# EAGLE board MainECU rev1 (EAGLE 9.2.2)
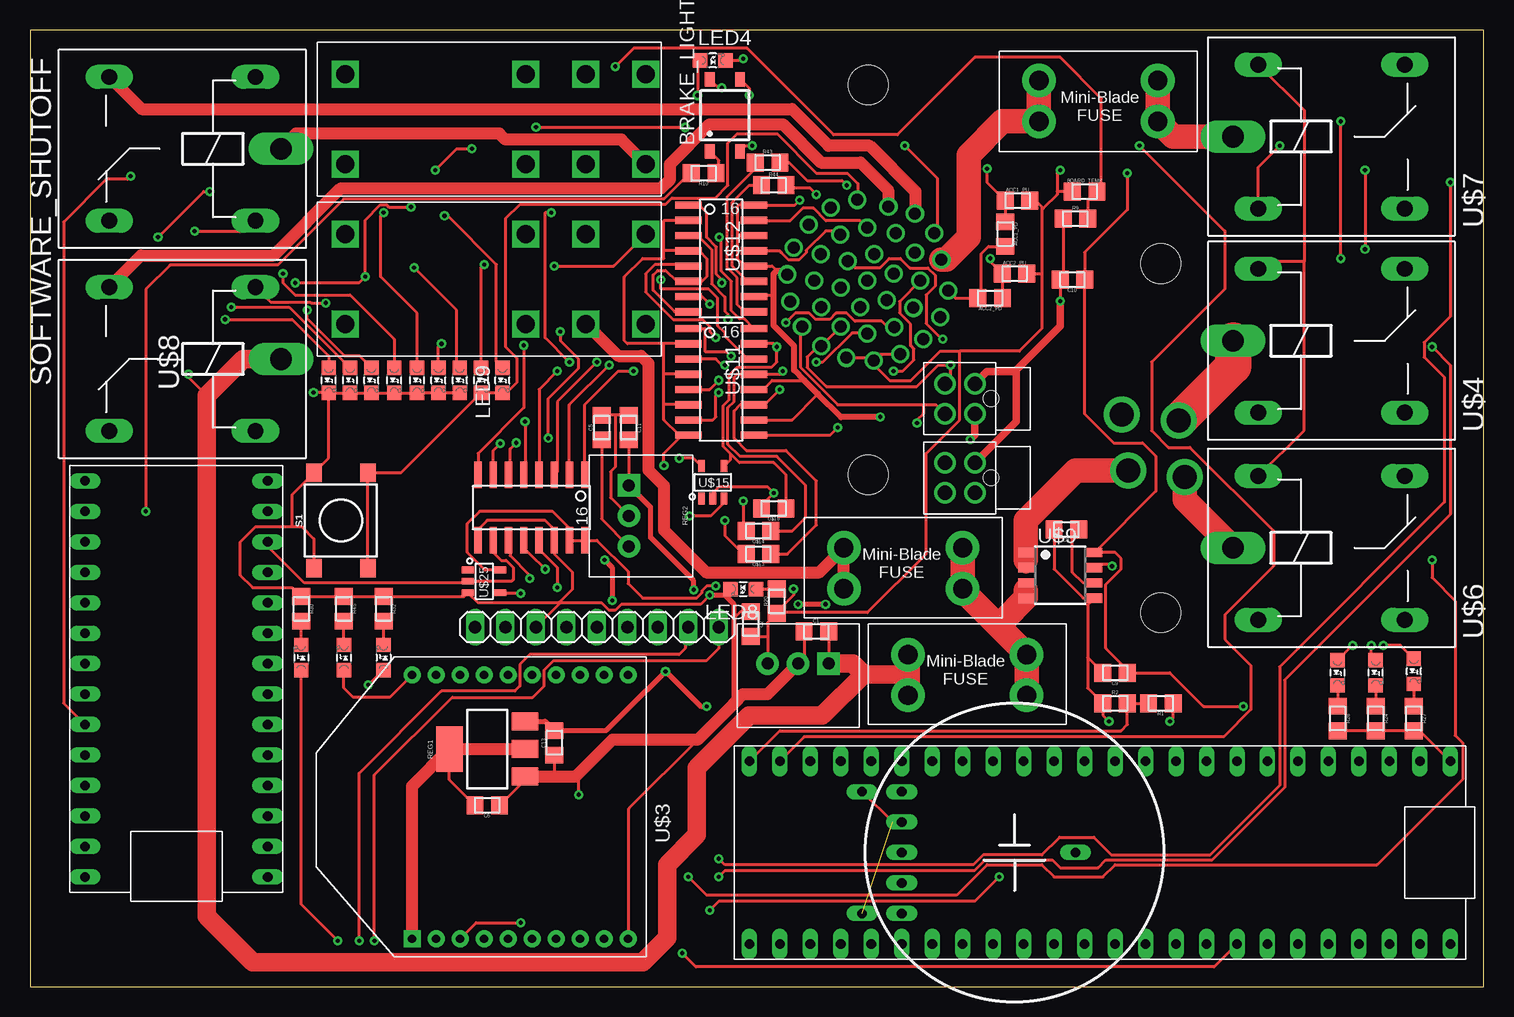
[diagram p1: board, top side]
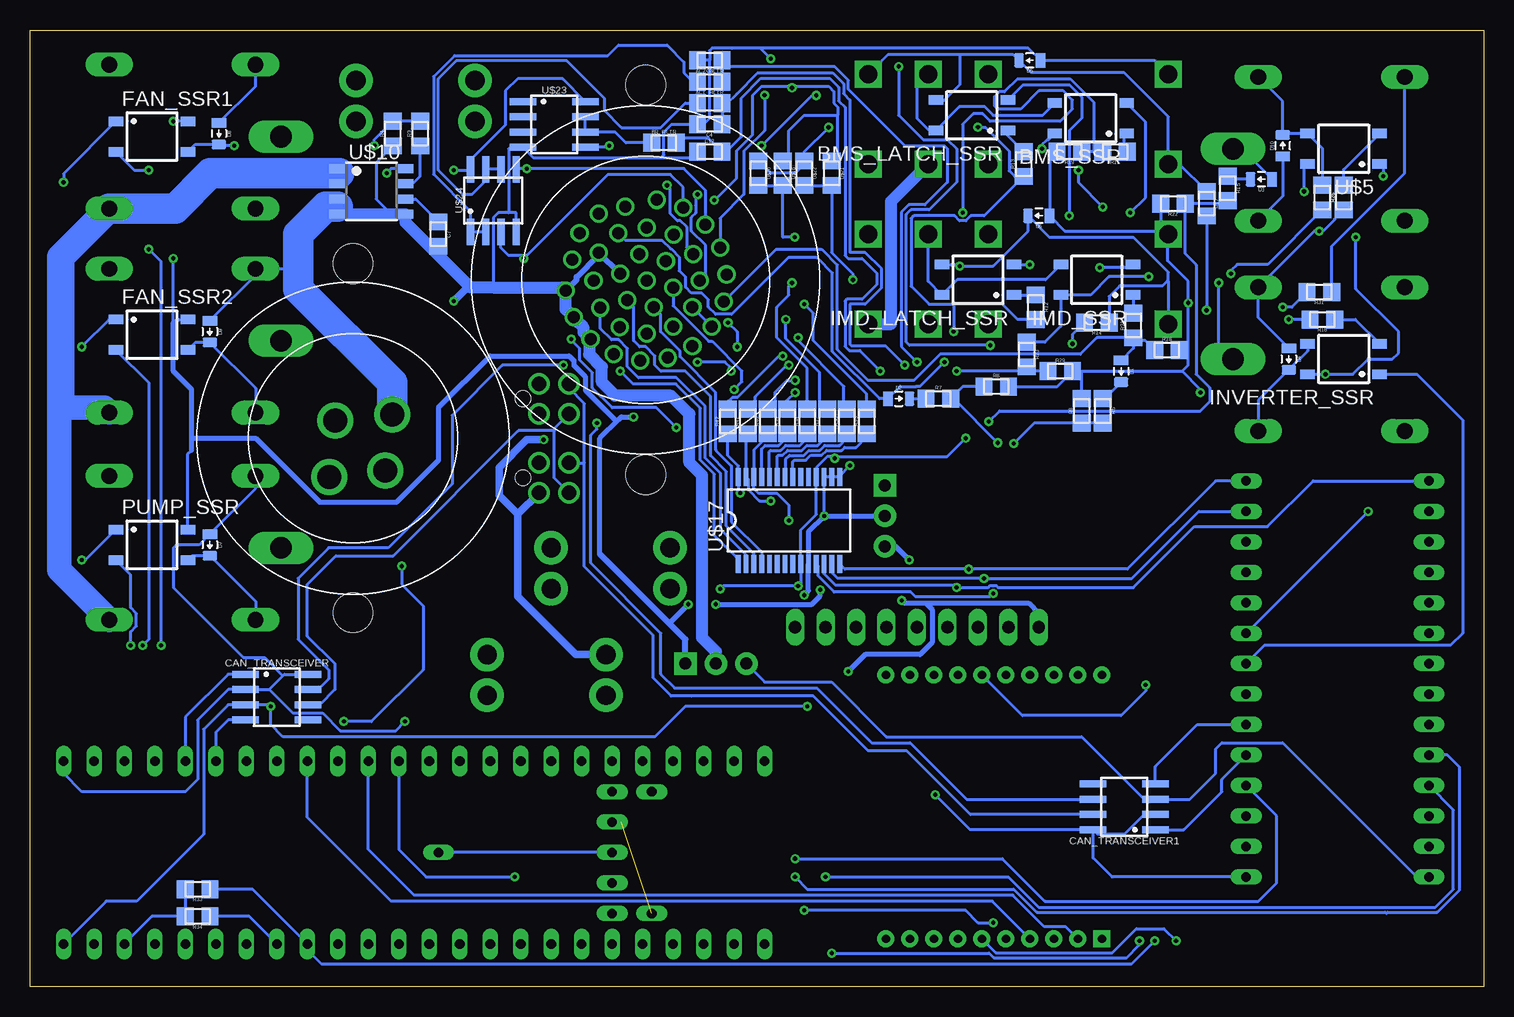
[diagram p2: board, bottom side, seen from below]

Size 121.16 x 79.76 mm. Coordinates in mm from the lower left corner, seen from the top.
Outline: 0,0 121.16,0 121.16,79.76 0,79.76 0,0
Copper layers (1*16): Top 0.035mm / dielectric 1.5mm / Bottom 0.035mm
Design rules "DRC Advanced Circuits": minimum track width 6mil, minimum drill 10mil, track to track 6mil, track to pad 6mil, pad to pad 6mil, via to via 6mil, smd to smd 6mil, copper to edge 40mil, drill to drill 6mil, minimum pad ring 10mil, minimum via ring 8mil, stop-mask expansion 4mil, vias tented up to drill 0mil, thermal gap 10mil

## Footprints (pad centres in the part's own frame; a part is rotated, then mirrored left to right if it is on the bottom)
MINI-BLADE_FUSE_HOLDER = drill 1.613 pad 2.794: L1 0,3.404; L2 0,0; R1 9.906,3.404; R2 9.906,0
0805 = smd 1.4 x 1.5: 1 -1.025,0; 2 1.025,0
1X09 = drill 1.016 long: 1 -8.89,0; 2 -6.35,0; 3 -3.81,0; 4 -1.27,0; 5 1.27,0; 6 3.81,0; 7 6.35,0; 8 8.89,0; 9 11.43,0
SOP04 = smd 0.8 x 1.2: 1 -1.27,-3; 2 1.27,-3; 3 1.27,3; 4 -1.27,3
SOIC-08 = smd 0.6 x 2.2: 1 -1.905,-2.6; 2 -0.635,-2.6; 3 0.635,-2.6; 4 1.905,-2.6; 5 1.905,2.6; 6 0.635,2.6; 7 -0.635,2.6; 8 -1.905,2.6
0805_D = smd 0.8 x 1.2: A -0.9,0; C 0.9,0
G2RL-2 = drill 1.5 square: 2 10.008,0; 3 5.004,0; 4 0,0; 5 0,7.493; 6 5.004,7.493; 7 10.008,7.493; COIL+ 25.019,0; COIL- 25.019,7.493
LED-805 = smd 1.2 x 1.2: A 0,-1.05; C 0,1.05
OKI-78SR = drill 1 pad 1.88 square: 1 -2.54,0 | drill 1 pad 1.88: 2 0,0; 3 2.54,0
SOT223 = smd 1.5 x 2.235: 1 -2.3,-3.15; 2 0,-3.15; 3 2.3,-3.15 | smd 3.8 x 2.2: 4 0,3.15
TACTILE_SWITCH_SMD_6.2MM_TALL = smd 1.55 x 1.3: A1 -3.975,-2.25; A2 3.975,-2.25; B1 -3.975,2.25; B2 3.975,2.25
ZF112 = drill 1.321 long: 1 4.064,14.884; 2 4.064,2.896; O 16.256,14.884; S 16.256,2.896 | drill 1.803 long: P 1.956,8.89
TEENSY_3.2_SIMPLE = drill 0.8 long: 3.3V 16.51,29.21; A0 16.51,3.81; A1 16.51,6.35; A2 16.51,8.89; A3 16.51,11.43; A4 16.51,13.97; A5 16.51,16.51; A6 16.51,19.05; A7 16.51,21.59; A8 16.51,24.13; A9 16.51,26.67; AGND 16.51,31.75; D0(RX1) 1.27,31.75; D1(TX1) 1.27,29.21; D2 1.27,26.67; D3(CANTX) 1.27,24.13; D4(CANRX) 1.27,21.59; D5 1.27,19.05; D6 1.27,16.51; D7(RX3) 1.27,13.97; D8(TX3) 1.27,11.43; D9(RX2) 1.27,8.89; D10(TX2) 1.27,6.35; D11 1.27,3.81; D12 1.27,1.27; D13 16.51,1.27; GND 1.27,34.29; VIN 16.51,34.29
TEENSY_3.5_EXT = drill 0.8 long: 3.3V 16.51,54.61; 3.3V_1 1.27,24.13; 3.3V_2 6.35,13.97; A0 16.51,29.21; A1 16.51,31.75; A2 16.51,34.29; A3 16.51,36.83; A4 16.51,39.37; A5 16.51,41.91; A6 16.51,44.45; A7 16.51,46.99; A8 16.51,49.53; A9 16.51,52.07; A12 1.27,3.81; A13 1.27,1.27; A14 16.51,1.27; A15 16.51,3.81; A16 16.51,6.35; A17 16.51,8.89; A18 16.51,11.43; A19 16.51,13.97; A20 16.51,16.51; A21 16.51,19.05; A22 16.51,21.59; AGND 16.51,57.15; D0(RX1) 1.27,57.15; D1(TX1) 1.27,54.61; D2 1.27,52.07; D3(CANTX) 1.27,49.53; D4(CANRX) 1.27,46.99; D5 1.27,44.45; D6 1.27,41.91; D7(RX3) 1.27,39.37; D8(TX3) 1.27,36.83; D9(RX2) 1.27,34.29; D10(TX2) 1.27,31.75; D11 1.27,29.21; D12 1.27,26.67; D13 16.51,26.67; D24 1.27,21.59; D25 1.27,19.05; D26 1.27,16.51; D27 1.27,13.97; D28 1.27,11.43; D29 1.27,8.89; D30 1.27,6.35; GND 1.27,59.69; GND_1 16.51,24.13; GND_2 8.89,13.97; PROG 11.43,13.97; RST 13.97,13.97; VBAT 3.81,13.97; VIN 16.51,59.69
XBEE = drill 0.7 pad 1.422 square: 1 -11,5.5 | drill 0.7 pad 1.422: 2 -11,3.5; 3 -11,1.5; 4 -11,-0.5; 5 -11,-2.5; 6 -11,-4.5; 7 -11,-6.5; 8 -11,-8.5; 9 -11,-10.5; 10 -11,-12.5; 11 11,-12.5; 12 11,-10.5; 13 11,-8.5; 14 11,-6.5; 15 11,-4.5; 16 11,-2.5; 17 11,-0.5; 18 11,1.5; 19 11,3.5; 20 11,5.5
SOP8 = smd 0.76 x 1.27: 1 -1.905,-2.86; 2 -0.635,-2.86; 3 0.635,-2.86; 4 1.905,-2.86; 5 1.905,2.86; 6 0.635,2.86; 7 -0.635,2.86; 8 -1.905,2.86
SOIC-16 = smd 0.6 x 2.2: 1 -4.445,-2.794; 2 -3.175,-2.794; 3 -1.905,-2.794; 4 -0.635,-2.794; 5 0.635,-2.794; 6 1.905,-2.794; 7 3.175,-2.794; 8 4.445,-2.794; 9 4.445,2.667; 10 3.175,2.667; 11 1.905,2.667; 12 0.635,2.667; 13 -0.635,2.667; 14 -1.905,2.667; 15 -3.175,2.667; 16 -4.445,2.667
SOT-23-5 = smd 1 x 0.55: 1 -1.35,0.95; 2 -1.35,0; 3 -1.35,-0.95; 4 1.35,-0.95; 5 1.35,0.95
SSOP28 = smd 0.4 x 1.5: 1 -4.225,-3.625; 2 -3.575,-3.625; 3 -2.925,-3.625; 4 -2.275,-3.625; 5 -1.625,-3.625; 6 -0.975,-3.625; 7 -0.325,-3.625; 8 0.325,-3.625; 9 0.975,-3.625; 10 1.625,-3.625; 11 2.275,-3.625; 12 2.925,-3.625; 13 3.575,-3.625; 14 4.225,-3.625; 15 4.225,3.625; 16 3.575,3.625; 17 2.925,3.625; 18 2.275,3.625; 19 1.625,3.625; 20 0.975,3.625; 21 0.325,3.625; 22 -0.325,3.625; 23 -0.975,3.625; 24 -1.625,3.625; 25 -2.275,3.625; 26 -2.925,3.625; 27 -3.575,3.625; 28 -4.225,3.625
CR-2450/G1AN = drill 0.8 long: +_0 -5.08,12.7; +_1 5.08,12.7; - 0,-5.08
AUTOSPORT_14-35 = drill 1: P$1 1.143,6.655; P$2 3.124,5.512; P$3 5.359,4.064; P$4 6.452,2.032; P$5 6.756,-0.254; P$6 6.274,-2.489; P$7 5.08,-4.445; P$8 3.302,-5.893; P$9 1.143,-6.655; P$10 -1.143,-6.655; P$11 -3.302,-5.893; P$12 -5.08,-4.445; P$13 -6.274,-2.489; P$14 -6.756,-0.254; P$15 -6.452,2.032; P$16 -5.359,4.064; P$17 -3.124,5.512; P$18 -1.143,6.655; P$19 1.143,4.369; P$20 3.124,3.023; P$21 4.318,1.016; P$22 4.318,-1.27; P$23 3.124,-3.226; P$24 1.143,-4.369; P$25 -1.143,-4.369; P$26 -3.124,-3.226; P$27 -4.318,-1.27; P$28 -4.318,1.016; P$29 -3.124,3.023; P$30 -1.143,4.369; P$31 1.143,1.88; P$32 2.286,-0.102; P$33 1.143,-2.083; P$34 -1.143,-2.083; P$35 -2.286,-0.102; P$36 -1.143,1.88; P$37 0,-0.102 | hole 3.3: -11.491,-11.491; 11.491,11.491
AUTOSPORT_12-04 = drill 2: P$1 0,3.81; P$2 3.708,0.889; P$3 0,-2.108; P$4 -3.708,0.889 | hole 3.3: -10.288,-10.288; 10.288,10.288
NANO-FIT_VERTICAL-4 = drill 1.2: P$1 -1.25,0; P$2 1.25,0; P$3 -1.25,2.5; P$4 1.25,2.5 | hole 1.3: 0,-1.34

## Placement (x,y rotation side)
5ABOARDFUSE  [MINI-BLADE_FUSE_HOLDER]  83.06,27.69 180 top
5AFUSE  [MINI-BLADE_FUSE_HOLDER]  84.07,72.14 0 top
5ASHUTDOWNFUSE  [MINI-BLADE_FUSE_HOLDER]  77.72,36.58 180 top
AC1_FILTR  510  [0805]  64.52,73.66 0 bottom
AC2_FILTR  510  [0805]  64.52,75.44 0 bottom
ACC1_PD  10k  [0805]  81.28,62.74 270 top
ACC1_PU  10k  [0805]  82.3,65.53 0 top
ACC2_PD  10k  [0805]  80.01,57.4 180 top
ACC2_PU  10k  [0805]  82.04,59.44 0 top
ADXL345_BREAKOUT  [1X09]  45.97,29.97 0 top
BMS_LATCH_SSR  CPC1002N  [SOP04]  42.67,72.64 90 bottom
BMS_SSR  CPC1002N  [SOP04]  32.77,72.39 90 bottom
BOARD_TEMP  THERMISTOR_NCP210805  [0805]  87.88,66.29 0 top
BR_FILTR  100  [0805]  68.33,70.36 0 bottom
BRAKE_LIGHT_SSR  CPC1002N  [SOP04]  57.91,72.64 0 top
C1  10uF  [0805]  65.53,29.59 0 top
C2  10uF  [0805]  60.07,30.23 270 top
C3  22µ  [0805]  64.52,77.22 180 bottom
C4  22µ  [0805]  64.52,71.88 180 bottom
C5  1uF  [0805]  47.62,46.61 90 top
C6  1uF  [0805]  38.1,15.11 180 top
C7  [0805]  87.12,62.74 270 bottom
C8  [0805]  86.36,38.1 180 top
C9  0.1uF  [0805]  90.42,26.16 180 top
C10  0.1uF  [0805]  86.87,58.93 180 top
C11  10uF  [0805]  49.91,46.61 270 top
C12  2.2µ  [0805]  64.52,69.6 0 bottom
C13  10uF  [0805]  43.69,20.32 90 top
CAN_TRANSCEIVER  MCP2551  [SOIC-08]  100.58,24.13 270 bottom
CAN_TRANSCEIVER1  MCP2551  [SOIC-08]  29.97,14.99 90 bottom
D1  DIODE0805  [0805_D]  30.23,51.31 270 bottom
D2  DIODE0805  [0805_D]  48.77,49.02 0 bottom
D3  DIODE0805  [0805_D]  18.54,67.31 180 bottom
D4  DIODE0805  [0805_D]  16.26,52.32 270 bottom
D5  DIODE0805  [0805_D]  37.85,77.22 180 bottom
D6  DIODE0805  [0805_D]  37.08,64.26 180 bottom
D7  DIODE0805  [0805_D]  106.17,36.83 270 bottom
D8  DIODE0805  [0805_D]  105.41,71.12 270 bottom
D9  DIODE0805  [0805_D]  106.17,54.61 270 bottom
D10  DIODE0805  [0805_D]  16.76,70.1 90 bottom
FAN_SSR1  CPC1002N  [SOP04]  111,70.87 270 bottom
FAN_SSR2  CPC1002N  [SOP04]  111,54.36 270 bottom
IMD_LATCH_SSR  CPC1002N  [SOP04]  42.16,58.93 90 bottom
IMD_SHUTDOWN  G2RL-2-DC12  [G2RL-2]  51.31,62.74 180 top
IMD_SHUTDOWN1  G2RL-2-DC12  [G2RL-2]  51.31,76.07 180 top
IMD_SSR  CPC1002N  [SOP04]  32.26,58.93 90 bottom
INVERTER_SSR  CPC1002N  [SOP04]  11.68,52.32 90 bottom
LED1  White  [LED-805]  37.59,50.55 180 top
LED2  White  [LED-805]  39.37,50.55 180 top
LED3  Green  [LED-805]  32.26,50.55 180 top
LED4  Red  [LED-805]  56.9,77.22 270 top
LED5  Yellow  [LED-805]  34.04,50.55 180 top
LED6  Red  [LED-805]  24.89,50.55 180 top
LED7  Green  [LED-805]  28.45,50.55 180 top
LED8  Purple  [LED-805]  59.44,33.15 90 top
LED9  Yellow  [LED-805]  35.81,50.55 180 top
LED10  Red  [LED-805]  29.46,27.43 0 top
LED11  Green  [LED-805]  22.61,27.43 0 top
LED12  Red  [LED-805]  115.32,26.29 180 top
LED13  Red  [LED-805]  108.97,26.16 180 top
LED14  Blue  [LED-805]  26.16,27.43 0 top
LED16  Red  [LED-805]  112.14,26.16 180 top
LED17  RED  [LED-805]  30.35,50.55 180 top
LED18  RED  [LED-805]  26.67,50.55 180 top
PUMP_SSR  CPC1002N  [SOP04]  111,36.83 270 bottom
R1  1K  [0805]  94.23,23.62 180 top
R2  2K  [0805]  90.42,23.62 0 top
R3  1K  [0805]  88.65,71.12 90 bottom
R4  2K  [0805]  90.93,71.12 90 bottom
R5  43k  [0805]  31.75,48.01 270 bottom
R6  12k  [0805]  33.53,48.01 90 bottom
R7  43k  [0805]  45.47,49.02 0 bottom
R8  12k  [0805]  40.64,50.04 0 bottom
R9  10k  [0805]  87.12,64.01 0 top
R10  43  [0805]  56.13,67.82 180 top
R11  150  [0805]  30.73,69.6 180 bottom
R12  33  [0805]  37.34,56.64 270 bottom
R13  33  [0805]  38.35,68.58 90 bottom
R14  2k  [0805]  32.26,55.37 180 bottom
R15  43k  [0805]  21.34,66.55 270 bottom
R16  43  [0805]  13.46,55.63 180 bottom
R17  20k  [0805]  23.11,65.28 270 bottom
R18  2.2k  [0805]  26.42,53.09 0 bottom
R19  10k  [0805]  34.54,69.6 180 bottom
R20  270  [0805]  62.23,32.13 90 top
R21  2k  [0805]  29.21,55.12 90 bottom
R22  12k  [0805]  25.91,65.28 180 bottom
R23  43k  [0805]  38.1,52.7 270 bottom
R24  33  [0805]  112.14,22.35 270 top
R25  330  [0805]  11.68,65.79 90 bottom
R26  1.2K  [0805]  13.46,65.79 270 bottom
R27  33  [0805]  115.32,22.35 270 top
R28  33  [0805]  108.97,22.35 270 top
R29  12k  [0805]  35.31,51.31 0 bottom
R30  33  [0805]  22.61,31.5 270 top
R31  6.8k  [0805]  13.72,57.91 180 bottom
R32  1.2k  [0805]  29.46,31.5 270 top
R33  4.7k  [0805]  107.19,8.13 180 bottom
R34  4.7k  [0805]  107.19,5.84 180 bottom
R35  270  [0805]  51.44,47.12 90 bottom
R36  270  [0805]  53.09,47.12 90 bottom
R37  270  [0805]  54.74,47.12 90 bottom
R38  270  [0805]  56.39,47.12 90 bottom
R39  270  [0805]  58.04,47.12 90 bottom
R40  270  [0805]  59.69,47.12 90 bottom
R41  270  [0805]  61.34,47.12 90 bottom
R42  270  [0805]  62.99,47.12 90 bottom
R43  0  [0805]  61.47,68.71 0 top
R44  0  [0805]  61.98,66.8 0 top
R45  0  [0805]  26.16,31.5 270 top
REG  5V  [OKI-78SR]  64.01,26.92 180 top
REG1  TLV1117LV33  [SOT223]  38.1,19.81 90 top
REG2  5V  [OKI-78SR]  49.91,39.24 270 top
S1  [TACTILE_SWITCH_SMD_6.2MM_TALL]  25.91,38.86 90 top
SOFTWARE_SHUTOFF  G5LE  [ZF112]  22.86,78.74 180 top
U$1  TEENSY_3.2_SIMPLE  [TEENSY_3.2_SIMPLE]  21.08,43.43 180 top
U$2  TEENSY_3.5_EXT  [TEENSY_3.5_EXT]  58.67,20.07 270 top
U$3  XBEE  [XBEE]  37.34,14.99 90 top
U$4  G5LE  [ZF112]  98.3,44.96 0 top
U$5  CPC1002N  [SOP04]  11.68,69.85 90 bottom
U$6  G5LE  [ZF112]  98.3,27.69 0 top
U$7  G5LE  [ZF112]  98.3,61.98 0 top
U$8  G5LE  [ZF112]  22.86,61.21 180 top
U$9  ACS715_CURRENT_SENSOR  [SOP8]  85.85,34.29 270 top
U$10  ACS715_CURRENT_SENSOR  [SOP8]  92.71,66.29 270 bottom
U$11  TLP291-4  [SOIC-16]  57.66,50.42 270 top
U$12  TLP291-4  [SOIC-16]  57.66,60.71 270 top
U$13  JUMPER  [0805]  60.71,36.07 180 top
U$14  JUMPER  [0805]  60.71,37.97 180 top
U$15  SN74LV1T34  [SOT-23-5]  56.9,42.04 90 top
U$16  JUMPER  [0805]  58.42,67.82 270 bottom
U$17  MCP23S17SSOP28  [SSOP28]  57.91,38.86 0 bottom
U$18  MCP3208SOIC  [SOIC-16]  41.78,39.88 180 top
U$19  JUMPER  [0805]  61.98,39.88 180 top
U$20  JUMPER  [0805]  60.45,67.82 270 bottom
U$21  JUMPER  [0805]  54.36,67.82 270 bottom
U$22  JUMPER  [0805]  56.64,67.82 270 bottom
U$23  MCP6002SOIC  [SOIC-08]  77.47,71.88 270 bottom
U$24  MCP6002SOIC  [SOIC-08]  82.55,65.53 0 bottom
U$25  SN74LVC1G06  [SOT-23-5]  37.85,33.78 0 top
U$26  CR-2450/G1AN  [CR-2450/G1AN]  82.04,11.18 90 top
X1  CONNECTOR-37  [AUTOSPORT_14-35]  69.85,58.93 45 bottom
X2  CONNECTOR-4AUTOSPORT  [AUTOSPORT_12-04]  94.23,45.72 225 bottom
X3  CONNECTOR-4NANO-FIT-VERTICAL-4  [NANO-FIT_VERTICAL-4]  78.74,49.02 90 top
X4  CONNECTOR-4NANO-FIT-VERTICAL-4  [NANO-FIT_VERTICAL-4]  78.74,42.42 90 top

## Tracks (layer width: path | path; a pad name or v marks a point on that pad's centre or on a via)
3.3V
  Bottom 0.254: U$2.3.3V 111,5.84 R34.2 R33.2
12VIN
  Top 1.016: 82.99,35.56 U$9.2
  Top 2.032: 82.99,35.56 U$9.1 82.99,38.86 87.16,43.03 X2.P$1
12VSUPPLY_READ  (via drill 0.35)
  Top 0.254: v43.94,51.31 42.42,49.78 U$18.4
  Bottom 0.254: R29.1 37.73,51.31 R23.2 38.47,51.31 v43.94,51.31
12VUNFUSED
  Top 0.508: 82.99,33.02 U$9.3
  Top 2.032: 5ABOARDFUSE.L1 5ABOARDFUSE.L2 81.15,29.59 | 5ASHUTDOWNFUSE.L2 5ASHUTDOWNFUSE.L1 77.72,33.02 81.15,29.59 | 82.99,33.02 U$9.4 81.15,30.55 81.15,29.59
+5V  (via drill 0.35, 0.35 pad 0.55)
  Top 0.254: v85.85,68.07 85.6,67.82 85.6,66.29 | 85.6,66.29 85.6,66.04 84.45,64.9 84.33,65.02 | 77.47,52.98 77.47,47.24 74.68,44.45 74.68,36.07 69.79,31.18 62.3,31.18 R20.1 | v44.2,54.61 44.2,53.85 45.72,52.32 45.72,51.56 43.18,49.02 v43.18,45.72 | C2.2 61.47,29.2 | ACC1_PU.2 83.82,65.53 84.33,65.02 | 84.33,65.02 84.33,59.44 | 84.33,59.44 84.33,54.86 82.45,52.98 77.47,52.98 | ACC2_PU.2 84.33,59.44 | U$15.5 55.28,44.05 v54.1,44.05 | v42.16,71.65 54.59,71.65 v54.61,71.63 | X1.P$11 70.07,52.43 X1.P$12 | X1.P$12 70.84,52.73 X1.P$13 | X1.P$12 70.3,51.88 71.63,50.55 73.41,50.55 75.84,52.98 77.47,52.98 | BOARD_TEMP.1 85.6,66.29 | R20.1 61.47,30.34 61.47,29.2 | 61.47,29.2 REG.3 | U$25.5 37.91,34.73 36.45,36.2 36.45,38.61 37.47,39.62 43.56,39.62 44.96,38.23 U$18.15 U$18.16 47.24,37.21 49.85,34.61 49.85,33.59 51.05,32.38 55.55,32.38 55.98,32.82 55.98,33 56.39,33.4 v57.15,33.4 | v63.63,33.15 63.63,32.64 62.23,31.24 R20.1
  Bottom 0.254: REG.3 59.94,25.4 54.36,25.4 49.78,20.83 33.53,20.83 28.32,15.62 CAN_TRANSCEIVER1.3 24.51,15.62 22.35,17.78 22.35,19.81 21.84,20.32 16.76,20.32 5.59,9.14 U$1.VIN | U$23.8 76.78,75.69 80.52,75.69 81.53,74.68 81.53,71.83 84.45,68.91 U$24.8 84.52,68.07 v85.85,68.07 | 44.2,56.9 v44.2,54.61 | 54.1,44.2 54.72,44.2 55.64,43.27 U$17.18 55.63,42.48 55.63,39.37 56.94,38.06 U$17.9 56.94,33.61 v57.15,33.4 63.37,33.4 v63.63,33.15 | 44.2,56.9 40.13,56.9 38.86,55.63 R12.2 | 44.2,56.9 46.23,56.9 47.73,58.4 47.73,64.03 47.5,64.26 44.11,64.26 43.71,63.86 43.16,63.86 42.76,64.26 41.65,64.26 R13.1 39.11,67.56 39.56,68.01 39.56,69.66 41.55,71.65 v42.16,71.65 | v54.1,44.05 54.1,44.2 | U$20.1 59.44,67.82 57.4,67.82 57.4,67.83 56.64,68.59 U$22.1 56.64,69.6 v54.61,71.63 | v43.18,45.72 44.7,44.2 54.1,44.2
+12V  (via drill 0.35, 0.35 pad 0.55)
  Top 0.254: v109.22,60.71 v109.22,72.14 | U$12.10 60.45,57.66 61.98,57.66 | 62.23,59.69 61.85,60.07 U$12.12 59.56,60.07 58.93,60.71 58.93,62.48 | 58.93,62.48 58.93,65.02 59.05,65.15 U$12.16 63.71,65.15 v64.13,65.57 | U$11.10 63.5,47.24 65.66,49.41 | 64.52,50.55 61.85,50.55 61.09,49.78 U$11.12 | U$12.14 59.05,62.61 58.93,62.48 | v13.21,51.05 13.21,50.8 14.73,49.28 | v10.67,62.48 14.48,66.29 v14.99,66.29 | BRAKE_LIGHT_SSR.4 57.36,74.93 v57.66,74.93 | v22.1,58.67 27.43,58.67 v27.94,59.18 27.94,63.92 29.19,65.17 29.74,65.17 29.91,65 v31.75,65 | v33.78,68.07 35.56,69.85 v36.83,69.85 | C1.2 66.56,26.93 REG.1 | C11.2 REG2.1
  Top 0.406: v66.29,31.88 v64.01,31.88 | REG2.1 51.69,40.01 51.69,37.47 55.31,33.85 v55.31,33.08
  Top 0.508: v70.87,47.5 70.84,47.47 67.6,47.47 65.66,49.41 64.52,50.55 63.68,51.39 63.68,53.42 61.98,55.12 61.98,57.66 61.98,59.44 62.23,59.69 62.8,59.69 X1.P$7
  Top 0.61: X3.P$1 78.74,45.97 v78.36,45.59
  Top 1.524: U$8.P 17.78,52.32 14.73,49.28 14.73,5.84 18.54,2.03 51.05,2.03 53.09,4.06 53.09,10.16 55.57,12.64 55.57,18.23 59.94,22.61 66.04,22.61 69.47,26.04 | 73.15,26.04 69.47,26.04 | REG.1 68.58,26.92 69.47,26.04
  Top 2.032: 5ABOARDFUSE.R2 73.15,26.04 5ABOARDFUSE.R1
  Bottom 0.254: PUMP_SSR.4 108,44.4 107.7,44.7 | FAN_SSR2.4 108.97,55.63 109.22,55.37 v109.22,60.71 | FAN_SSR1.4 v109.22,72.14 | R23.1 36.58,53.73 35.26,55.05 IMD_SSR.4 32.77,57.66 31.24,59.18 v27.94,59.18 | 53.85,72.64 53.85,69.35 U$21.1 | INVERTER_SSR.4 v13.21,51.05 10.92,51.05 9.65,52.32 7.62,52.32 7.11,52.83 7.11,54.61 10.67,58.17 v10.67,62.48 | v14.99,66.29 14.99,68.28 U$5.4 | U$16.1 57.91,69.35 57.91,71.37 56.64,72.64 53.85,72.64 | U$8.P 22.1,53.52 v22.1,58.67 | v31.75,65 33.78,67.03 v33.78,68.07 | BMS_SSR.4 36.26,70.62 36.38,70.62 36.83,70.18 v36.83,69.85 | 53.85,72.64 53.85,73.34 54.18,73.67 54.18,74.62 54.61,75.06 57.53,75.06 v57.66,74.93 57.78,75.06 60.2,75.06 60.96,74.3 60.96,70.99 62.29,69.66 62.29,67.37 64.1,65.57 v64.13,65.57
  Bottom 0.406: 107.7,44.7 107.7,45.72 | 107.7,45.72 107.7,49.78 109.22,51.31 109.22,55.37 | 73.66,36.07 73.66,45.72 72.14,47.24 | v70.87,47.5 71.88,47.5 72.14,47.24 | 107.7,45.72 102.36,45.72 97.03,40.39 90.61,40.39 87.12,43.87 87.12,48.26 82.8,52.58 76.22,52.58 75.84,52.2 75.84,51.82 74.88,50.85 74.88,49.73 72.39,47.24 72.14,47.24 | 67.88,30.29 v66.29,31.88 | v55.31,33.08 55.31,32.58 56.01,31.88 v64.01,31.88
  Bottom 0.508: REG.1 66.55,28.96 67.88,30.29 73.66,36.07
  Bottom 0.61: X4.P$1 80.52,39.39 | 5ABOARDFUSE.R2 75.69,27.69 80.52,32.51 80.52,39.39 | v78.36,45.59 79.75,45.59 82.05,43.29 82.05,40.92 80.52,39.39
BMS_COIL_PWR
  Bottom 0.254: BMS_LATCH_SSR.3 44.96,73.91 43.69,75.18 43.69,77.72 | IMD_SHUTDOWN1.4 49.66,77.72 43.69,77.72 | 43.69,77.72 39.25,77.72 D5.C 37.73,76.2 29.97,76.2 26.29,72.52 IMD_SHUTDOWN1.COIL- 25.39,68.58 R17.1
BMS_OK  (via drill 0.35 pad 0.55)
  Top 0.254: v43.43,64.52 42.93,64.52 42.93,54.1 v44.96,52.07
  Bottom 0.254: v44.96,52.07 46.98,50.05 47.31,50.05 47.32,50.04 48.65,50.04 D2.A 50.36,49.02 54.29,52.95 54.29,59.49 55.57,60.77 57.99,60.77 62.69,56.06 64.03,56.06 64.64,56.67 64.64,57.27 65.19,57.82 66.04,57.82 66.52,58.3 66.52,59.15 67.06,59.69 67.06,60.83 67.73,61.51 67.78,61.51 68.51,62.23 71.54,62.23 X1.P$19 | 32.51,69.6 32.51,73.73 34.48,75.69 38.86,75.69 39.96,74.59 40.39,74.59 40.77,74.21 40.77,73.41 40.51,73.15 38.61,73.15 37.08,74.68 35.05,74.68 34.29,73.91 34.29,73.15 35.31,72.14 41.15,72.14 41.78,72.77 42.55,72.77 43.43,71.88 v43.43,64.52 | 32.51,69.6 R19.1 | R11.2 32.51,69.6
BMS_OK_READ  (via drill 0.35 pad 0.55)
  Top 0.254: U$18.6 40.01,42.8 40.01,44.83 v40.51,45.34
  Bottom 0.254: R8.1 43.42,50.04 R7.2 44.2,49.02 v40.51,45.34
BMS_PWR_STEP
  Bottom 0.254: BMS_SSR.3 36.78,72.64 40.89,72.64 41.59,73.34 43.7,73.34 BMS_LATCH_SSR.4 46.23,71.37 47.24,72.39 47.24,75.13 IMD_SHUTDOWN1.3
BRAKE_LIGHT  (via drill 0.35 pad 0.55)
  Top 0.254: BRAKE_LIGHT_SSR.3 59.94,74.88 v59.94,74.32
  Bottom 0.254: v59.94,74.32 59.94,71.37 61.66,69.66 61.66,66.05 63.65,64.06 X1.P$6
BRAKE_LIGHT_CTRL  (via drill 0.35)
  Top 0.254: v9.65,39.62 9.65,58.14 11.68,60.17 20.65,60.17 26.13,65.66 52.81,65.66 54.97,67.82 R10.2
  Bottom 0.254: v9.65,39.62 U$1.D7(RX3)
CANH  (via drill 0.35)
  Top 0.254: X3.P$4 76.71,50.74 v76.71,51.82 75.69,51.82 73.91,50.04 66.36,50.04 64.77,51.63 64.77,52.49 65.26,52.98 65.52,52.98 X1.P$10 | X1.P$10 | X1.P$10 X1.P$25
  Bottom 0.254: CAN_TRANSCEIVER1.7 42.8,14.35 48.11,19.66 51.31,19.66 55.88,24.23 66.04,24.23 67.73,24.23 69.24,25.74 69.24,29.3 74.95,35.01 74.95,43.67 | X4.P$4 74.95,43.67 | 74.95,43.67 74.95,48.61 76.24,49.89 X3.P$4 | v76.71,51.82 81.79,51.82 85.98,47.62 85.98,41.91 91.31,36.58 96.27,36.58 98.81,34.04 98.81,28.96 96.27,26.42 96.27,25.65 97.16,24.77 CAN_TRANSCEIVER.7
CANL  (via drill 0.35)
  Top 0.254: 74.42,48.51 67.31,48.51 64.21,51.61 64.21,54.91 X1.P$9 | 74.42,48.51 75.5,48.51 X3.P$3 | 74.42,48.51 74.42,47.75 73.91,47.24 v73.91,46.99
  Bottom 0.254: CAN_TRANSCEIVER1.6 43.11,15.62 47.81,20.32 51.01,20.32 55.59,24.89 67.44,24.89 68.58,26.04 68.58,29.46 74.42,35.31 74.42,45.97 73.91,46.48 v73.91,46.99 | X4.P$3 77.47,42.4 77.47,46.35 | 77.47,46.35 80.45,46.35 90.9,35.91 95.66,35.91 98.04,33.53 98.04,29.21 95.76,26.92 95.76,24.77 97.03,23.5 CAN_TRANSCEIVER.6 | X3.P$3 77.47,46.54 77.47,46.35 | X1.P$24 X1.P$9 | X1.P$9
CHIP_SELECT
  Top 0.254: U$1.D10(TX2) 19.81,36.7 22.86,33.66 36.37,33.66 U$25.2 40.13,33.78 40.28,33.93 40.28,34.94 39.69,35.54 39.26,35.54 38.61,36.2 U$18.10
CHIP_SELECT_INVERTED  (via drill 0.35)
  Top 0.254: U$25.4 40.89,32.83 v40.89,32.77
  Bottom 0.254: v40.89,32.77 41.15,32.51 47.37,32.51 47.75,32.89 54.14,32.89 55.47,34.22 55.47,35.07 U$17.11
COOLINGSENSE  (via drill 0.35)
  Top 0.254: U$2.A12 64.52,20.83 99.48,20.83 101.75,23.1 101.75,26.77 99.57,28.96 99.57,30.99 103.63,35.05 103.63,37.97 96.65,44.96 94.87,44.96 93.47,46.35 93.47,52.07 99.57,58.17 99.57,62.99 v92.46,70.1
  Bottom 0.254: R3.2 R4.2 92.46,70.62 v92.46,70.1
CURRENTSENSE2
  Bottom 0.254: U$10.1 95.57,68.01 95.38,67.82 95.38,67.12 U$10.2
  Bottom 2.032: U$6.S 118.72,34.75 118.72,48.26 118.6,48.26 114.96,48.26 U$4.S
  Bottom 2.286: U$7.S 118.6,60.83 118.6,48.26
  Bottom 2.54: U$7.S 109.07,64.87 106.12,67.82 95.38,67.82
DASH_CTRL1
  Bottom 0.254: U$17.21 57.59,43.76 57.45,43.89 56.49,43.89 56.08,44.3 55.19,44.3 54.78,44.71 53.52,44.71 53.27,44.96 52.32,44.96 51.44,45.85 R35.1
DASH_CTRL2
  Bottom 0.254: U$17.22 58.17,42.56 58.17,44 57.86,44.3 56.66,44.3 56.25,44.71 55.35,44.71 54.95,45.11 53.69,45.11 53.09,45.72 R36.1
DASH_CTRL3
  Bottom 0.254: R37.1 54.74,45.85 54.79,45.85 55.52,45.11 56.42,45.11 56.83,44.7 58.03,44.7 58.44,44.3 58.82,44.3 58.89,44.24 U$17.23
DASH_CTRL4
  Bottom 0.254: U$17.24 59.54,44.6 59.44,44.71 58.6,44.71 58.2,45.11 56.99,45.11 56.39,45.72 R38.1
DASH_CTRL5
  Bottom 0.254: U$17.25 60.19,44.83 59.9,45.11 58.77,45.11 58.04,45.85 R39.1
DASH_CTRL6  (via drill 0.35 pad 0.55)
  Top 0.254: v57.91,38.86 57.91,37.59 59.44,36.07 U$13.2
  Bottom 0.254: R40.1 59.69,45.9 60.84,44.75 U$17.26 60.84,41.53 60.45,41.15 58.93,41.15 57.91,40.13 v57.91,38.86
DASH_CTRL7  (via drill 0.35 pad 0.55)
  Top 0.254: v59.44,40.49 59.43,40.48 59.43,38.23 U$14.2
  Bottom 0.254: R41.1 61.49,45.95 U$17.27 61.32,42.32 61.32,41.44 60.37,40.49 v59.44,40.49
DASH_CTRL8  (via drill 0.35 pad 0.55)
  Top 0.254: U$19.2 60.95,40.12 v61.98,41.15 61.47,41.66 57.4,41.66 56.9,41.15 U$15.2
  Bottom 0.254: R42.1 62.99,44.26 62.14,43.41 U$17.28 62.14,41.31 v61.98,41.15
DASH_CTRL9  (via drill 0.35)
  Top 0.254: X1.P$29 72.46,57.12 72.46,56.16 73.39,55.23 73.39,53.44 73.66,53.17 73.66,52.24 72.72,51.31 v71.96,51.31
  Bottom 0.254: U$17.1 62.14,35.63 64.14,37.63 64.14,42.73 65.3,43.9 65.3,48.22 67.33,50.24 70.89,50.24 v71.96,51.31
DASH_CTRL10
  Bottom 0.254: U$17.2 61.49,36 63.63,38.14 63.63,42.8 64.9,44.07 64.9,48.39 67.28,50.77 70.46,50.77 71.37,51.69 71.37,53.21 72.1,53.94 72.69,53.94 73.62,54.88 X1.P$28
DASH_CTRL11
  Bottom 0.254: U$17.3 60.84,36.11 63.12,38.39 63.12,42.93 64.45,44.26 64.45,49.21 66.55,51.31 68.58,51.31 69.09,51.82 69.09,52.58 69.85,53.34 70.36,53.34 70.87,53.85 70.87,56.71 X1.P$35
DASH_CTRL12
  Bottom 0.254: U$17.4 60.19,36.22 62.71,38.75 62.71,43.41 64.01,44.7 64.01,44.76 64.02,44.77 64.02,49.54 66.98,52.51 66.98,52.98 68.6,54.6 68.6,56.06 X1.P$34
DASH_IO1  (via drill 0.35)
  Top 0.254: v68.07,66.8 67.67,67.21 64.76,67.21 63.26,68.71 R43.2
  Bottom 0.254: X1.P$22 66.45,61.63 66.45,63.35 66.95,63.85 67.21,63.85 67.82,64.46 67.82,66.55 v68.07,66.8
DASH_IO2  (via drill 0.35)
  Top 0.254: v65.53,66.04 65.02,66.55 63.26,66.55 R44.2
  Bottom 0.254: v65.53,66.04 65.69,65.88 65.69,65.12 65.69,64.5 66.04,64.15 66.04,62.99 64.86,61.82 64.86,59.35 X1.P$23
DASH_IO3
  Top 0.254: X1.P$21 67.21,63 66.29,63 64.69,61.39 64.69,61.18 64.08,60.57 63.23,60.57 62.62,61.18 62.62,61.2 62.48,61.34 U$12.13
DASH_IO4
  Top 0.254: U$12.15 63.37,63.88 64.39,64.9 65.29,64.9 66.33,63.86 69.19,63.86 X1.P$20
DASH_IO5  (via drill 0.35 pad 0.55)
  Top 0.254: U$11.9 66.67,45.97 v67.31,46.61 | X1.P$32 68.69,59.94 70.84,59.94 71.6,60.71 72.53,60.71 73.32,59.92 74.82,59.92 75.44,59.3 75.44,58.42 74.68,57.66 74.68,55.28 75.97,53.99 v76.06,53.99
  Bottom 0.254: v67.31,46.61 68.96,48.26 72.64,48.26 74.3,49.91 74.3,51.18 75.36,52.25 75.36,53.18 76.06,53.88 v76.06,53.99
DASH_IO6  (via drill 0.35)
  Top 0.254: v62.48,49.78 61.21,48.51 U$11.11 59.18,48.51 58.67,48.01 58.67,45.72 59.69,44.7 62.99,44.7 65.53,42.16 65.53,38.48 63.12,36.07 U$13.1
  Bottom 0.254: v62.48,49.78 61.83,50.44 61.83,51.33 64.31,53.8 64.6,53.8 67.57,56.77 X1.P$33
DASH_IO7  (via drill 0.35)
  Top 0.254: v62.74,51.31 62.74,51.05 U$11.13 58.93,51.05 58.67,50.8 58.67,48.77 58.17,48.26 58.17,45.21 59.18,44.2 62.23,44.2 64.64,41.78 64.64,39.12 63.5,37.97 U$14.1 | v65.53,52.07 66.07,52.07 68.5,54.51 69.71,54.51 X1.P$26
  Bottom 0.254: v65.53,52.07 63.25,52.07 62.74,51.56 v62.74,51.31
DASH_IO8  (via drill 0.35)
  Top 0.254: U$19.1 63,42.66 61.98,43.69 59.12,43.69 58.39,44.42 | 58.39,44.42 57.76,45.04 57.76,48.43 58.27,48.94 58.27,50.97 58.93,51.63 61.79,51.63 62.23,52.07 v62.23,53.34 61.98,53.59 U$11.15 | U$15.4 58.39,43.93 58.39,44.42 | X1.P$27 71.46,54.98 70.97,55.47 68.73,55.47 68.07,56.13 67.16,56.13 66.64,55.61 65.47,55.61 64.95,56.13 63.75,56.13 v62.99,55.37
  Bottom 0.254: v62.99,55.37 62.23,54.61 v62.23,53.34
ECUSENSE
  Top 0.254: R1.2 R2.2 91.45,21.85 90.93,21.34 62.48,21.34 U$2.A13
FAN1-
  Top 2.032: 5AFUSE.R1 5AFUSE.R2 95.25,70.87 U$7.P
FAN2-
  Top 3.048: X2.P$3 100.25,51.74 U$4.P
GND  (via drill 0.35, 0.35 pad 0.55)
  Top 0.254: U$7.1 106.17,73.05 106.17,60.45 | 106.17,60.45 102.97,60.45 U$4.1 | U$6.1 106.17,46.38 106.17,60.45 | v89.92,22.1 89.4,22.61 R2.1 88.14,24.88 88.14,27.42 | R28.2 R24.2 R27.2 115.83,21.33 U$2.GND | REG1.1 41.25,17.24 C6.1 | C13.1 43.69,17.51 | U$3.10 49.91,4.06 49.91,14.86 55.63,20.57 | U$12.2 52.83,63.88 52.83,61.34 | U$11.8 54.36,45.97 | 54.36,45.97 54.1,45.97 52.83,47.24 52.83,48.51 | 52.83,61.34 U$12.4 55.75,61.34 56.39,60.71 56.39,59.18 56.01,58.8 U$12.6 53.89,58.8 52.98,59.71 52.31,59.71 51.92,59.33 51.92,58.06 53.72,56.26 U$12.8 | U$11.2 52.83,53.59 | U$11.4 52.83,51.05 | U$11.6 52.83,48.51 | LED6.C LED18.C LED7.C LED17.C LED3.C LED5.C LED9.C | LED6.C 24.89,44.07 S1.B2 21.84,41.02 21.84,38.35 | 52.83,51.05 52.83,53.59 | 52.83,48.51 52.83,51.05 | 52.83,61.34 52.83,60.71 51.05,60.71 49.53,59.18 49.53,53.85 49.78,53.59 52.83,53.59 | C1.1 64.51,27.42 62.61,25.53 | 58.67,23.62 58.67,30.73 | C2.1 59.19,31.25 58.67,30.73 | ACC1_PD.2 79.87,61.71 79.27,61.11 79.27,57.69 ACC2_PD.2 77.12,57.4 X1.P$16 | v54.97,39.24 56.75,39.24 57.85,40.34 U$15.3 | v13.72,62.99 17.93,62.99 SOFTWARE_SHUTOFF.1 | LED4.C 59.29,77.22 v59.44,77.37 | LED6.C 24.86,49.53 v23.62,49.53 | U$8.2 20.07,57.05 23.38,57.05 23.43,57 v24.64,57 | v52.83,43.43 52.83,44.45 54.36,45.97 | v85.85,57.15 v85.84,57.16 C10.2 86.1,59.18 R9.1 | C8.2 85.33,34.81 87.76,32.38 U$9.5 88.14,31.81 88.14,27.42 | 21.84,38.35 18.8,38.35 17.53,37.08 17.53,34.29 18.54,33.27 21.85,33.27 R30.1 R45.1 R32.1 36.19,32.52 U$25.3 37.3,32.03 44.09,32.03 44.2,32.13 | 21.84,38.35 22.64,38.35 23.66,37.34 S1.B1 | 88.14,27.42 C9.2 | v45.72,16 45.72,17.26 45.47,17.51
  Top 0.254: U$18.9 37.34,38.1 38.1,38.86 42.93,38.86 43.56,38.23 43.56,36.96 43.69,36.83 U$18.14 43.69,36.07 45.21,34.54 45.21,33.15 44.2,32.13 | 58.67,31.74 58.67,30.73 | C11.1 48.77,47.63 | 48.77,47.63 C5.2 | 48.77,47.63 48.77,43.31 48.39,42.93 48.39,40.77 REG2.2 | ADXL345_BREAKOUT.3 44.2,32 | 44.2,32 44.2,32.13 | 44.2,32 47.62,32 48.26,31.37 48.77,31.37 49.28,31.88 55.88,31.88 v56.64,32.64
  Top 0.406: 58.67,23.62 58.67,31.74 58.67,31.84 57.88,32.64 | v56.64,32.64 57.88,32.64 | 57.88,32.64 LED8.C
  Top 0.61: X3.P$2 79.74,51.27 82.04,51.27 82.17,51.4 | X4.P$2 82.17,47.1 82.17,51.4 | 82.17,51.4 85.85,55.08 v85.85,57.15
  Top 1.016: REG.2 62.61,25.53 61.47,24.38 59.44,24.38 58.67,23.62 55.63,20.57 48.53,20.57 45.47,17.51 43.69,17.51 REG1.1
  Bottom 0.254: 101.22,24.77 CAN_TRANSCEIVER.2 104.65,24.77 107.19,22.23 107.19,17.27 108.2,16.26 116.84,16.26 118.36,17.78 U$2.GND | CAN_TRANSCEIVER.8 99.95,26.04 100.08,25.91 | 101.22,24.77 100.08,25.91 | U$1.GND 30.99,9.14 32.57,10.73 CAN_TRANSCEIVER1.8 | CAN_TRANSCEIVER1.8 42.8,13.08 v45.72,16 | CAN_TRANSCEIVER1.2 28.32,14.35 29.97,12.7 32.19,12.7 CAN_TRANSCEIVER1.8 | 101.22,24.77 99.26,22.8 96.77,22.8 95.3,21.34 90.68,21.34 v89.92,22.1 | U$6.1 102.36,41.54 D7.A 107.07,36.83 108.97,36.83 109.22,36.58 109.22,33.27 103.38,27.43 101.6,27.43 100.08,25.91 | D9.A 102.36,59.32 U$4.1 98.96,59.84 98.81,59.69 | D8.A 102.36,75.07 U$7.1 | 26.35,62.8 26.54,62.99 34.91,62.99 D6.A 36.18,68.98 R19.2 | 26.35,62.8 IMD_SHUTDOWN.COIL+ 26.93,63.38 R22.2 | IMD_SHUTDOWN1.COIL+ 27.43,77.22 D5.A 37.96,78.23 60.3,78.23 | 33.53,51.31 R29.2 35.55,50.04 R8.2 | 33.53,51.31 25.15,51.31 | 25.15,51.31 24.64,51.82 24.64,53.09 | 24.64,53.09 v24.64,57 24.64,58.8 26.35,60.52 26.35,62.8 | D4.A 18.8,55.76 U$8.2 14.12,62.99 v13.72,62.99 13.39,62.99 12.43,63.95 12.43,64.01 R25.1 | U$24.4 80.64,64.52 81.28,64.52 | 81.28,64.52 82.13,64.52 82.55,64.09 82.55,58.29 | 81.28,64.52 81.28,69.85 81.15,69.98 U$23.4 79.18,69.09 68.58,69.09 | 64.52,77.22 C3.2 | 64.52,77.22 64.52,72.39 65.02,71.88 C4.2 67.69,71.88 68.33,71.25 68.33,69.34 68.58,69.09 | 68.58,69.09 66.05,69.09 C12.1 | R6.2 33.53,51.31 | R18.2 24.64,53.09 | D10.A 16.76,65.89 SOFTWARE_SHUTOFF.1 | v23.62,49.53 23.62,49.78 25.15,51.31 | v52.83,43.43 53.69,42.58 U$17.15 U$17.16 U$17.17 54.99,39.25 v54.97,39.25 v54.97,39.24 | R4.1 92.33,68.7 92.33,65.65 91.06,64.39 U$10.5
  Bottom 0.254: U$10.3 95.5,65.66 96.14,65.02 96.52,65.02 95.89,64.39 U$10.4 | 60.3,78.23 62.66,78.23 62.67,78.25 64.31,78.25 64.52,78.04 64.52,77.22 | v59.44,77.37 60.3,78.23
  Bottom 0.406: v56.64,32.64 56.29,32.99 U$17.10 56.29,37.93 v54.97,39.25 | v54.97,39.24 REG2.2
  Bottom 0.508: X1.P$36 | X1.P$36 X1.P$30 73.75,61.03 75.61,59.17 75.61,58.91 X1.P$16
  Bottom 0.61: C7.2 87.87,61.71 | v85.85,57.15 84.71,58.29 84.45,58.29
  Bottom 1.016: U$10.4 U$10.5 89.85,63.7 87.87,61.71 84.45,58.29 82.55,58.29 76.79,58.29 X1.P$16 76.51,56.47 X1.P$15 75.85,55.63 75.75,55.53 75.63,55.53 75.02,54.92 75.02,54.55 X1.P$14 74.57,53.84 74.57,52.73 73.51,51.66 73.51,50.39 72.39,49.28 67.74,49.28 66.22,47.75 66.22,43.68 65.15,42.61 65.15,29.08 64.01,27.94 REG.2
  Bottom 2.54: X2.P$4 90.98,50.34 98.81,58.17 98.81,59.69 98.81,62.74 96.52,65.02 95.5,65.02
IMD_COIL_PWR  (via drill 0.35)
  Top 0.254: IMD_SHUTDOWN.4 48.64,60.07 v43.69,60.07
  Bottom 0.254: 26.29,58.8 IMD_SHUTDOWN.COIL- | 26.29,58.8 26.35,58.86 26.8,58.42 30.35,58.42 31.23,57.54 R14.1 | 26.29,58.8 26.29,59.56 29.21,62.48 36.21,62.48 D6.C 37.98,62.99 40.91,60.07 v43.69,60.07 43.81,60.2 IMD_LATCH_SSR.3
IMD_PWR_STEP
  Bottom 0.254: IMD_SSR.3 36.53,58.93 43.89,58.93 IMD_LATCH_SSR.4 46.3,58.8 IMD_SHUTDOWN.3
INVERTER_CTRL
  Bottom 0.254: INVERTER_SSR.1 5.59,51.05 1.78,47.24 1.78,29.46 2.79,28.45 18.29,28.45 U$1.D6
INVERTER_SUPPLY
  Top 1.016: U$8.S 9.25,60.96 20.32,60.96 25.91,66.55 52.58,66.55 53.34,67.31 53.34,68.58 56.64,71.88 62.74,71.88 65.91,68.71 69.22,68.71 71.5,66.42 71.5,65.07 X1.P$2
LATCH_EXT_BUTTON
  Top 0.254: S1.A1 S1.A2 30.9,42.84 37.56,49.5 LED1.C LED2.C 39.69,49.5 40.58,50.38 40.58,52.39 39.62,53.34 39.62,64.01 40.87,65.25 52.98,65.25 53.48,65.75 57.12,65.75 58.17,66.8 58.17,70.33 58.93,71.09 62.26,71.09 65.56,67.79 68.14,67.79 68.98,66.95 68.98,65.64 X1.P$3
MISO_TEENSY  (via drill 0.35)
  Top 0.254: U$18.12 41.15,36.58 41.72,36.01 v42.93,34.8
  Bottom 0.254: U$1.D12 22.35,42.16 29.72,34.8 v42.93,34.8 53.25,34.8 U$17.14
MOSI_TEENSY  (via drill 0.35)
  Top 0.254: U$18.11 40.01,37.08 40.01,35.94 41.66,34.29 v41.66,34.04
  Bottom 0.254: U$1.D11 23.75,39.62 29.34,34.04 v41.66,34.04 53.85,34.04 53.98,34.16 54.34,34.52 U$17.13
N$1
  Top 2.032: 5AFUSE.L1 5AFUSE.L2 81.03,72.14 78.21,69.32 78.21,67.56 78.23,67.54 78.23,62.48 76.36,60.62 X1.P$17
N$2  (via drill 0.35 pad 0.55)
  Top 0.254: LED1.A 37.59,59.94 v37.85,60.2
  Bottom 0.254: IMD_LATCH_SSR.2 v37.85,60.2
N$3  (via drill 0.35)
  Top 0.254: v95,22.1 95.26,22.36 R1.1 | U$9.7 88.97,35.18 90.04,35.18 v90.17,35.05
  Bottom 0.254: v95,22.1 92.71,22.1 88.39,26.42 88.39,31.75 90.17,33.53 v90.17,35.05
N$4
  Bottom 0.254: U$6.2 102.36,32.12 D7.C 107.63,35.93 PUMP_SSR.3
N$5
  Bottom 0.254: IMD_LATCH_SSR.1 R12.1
N$6
  Bottom 0.254: R3.1 88.65,67.56 89.28,66.93 U$10.7
N$7  (via drill 0.35 pad 0.55)
  Top 0.254: LED4.A 55.63,77 v55.63,74.3 | BRAKE_LIGHT_SSR.2 59.64,70.1 v60.2,70.1
  Bottom 0.254: v60.2,70.1 56.01,74.3 v55.63,74.3
N$8
  Top 0.254: U$9.6 87.76,33.66 86.87,34.54 86.87,37.58 C8.1
N$9  (via drill 0.35 pad 0.55)
  Top 0.254: LED3.A 32.26,56.13 29.21,59.18 29.21,64.26 v29.46,64.52
  Bottom 0.254: BMS_SSR.2 28.19,72.09 28.19,65.79 v29.46,64.52
N$10
  Bottom 0.254: D1.C 31.6,49.03 R5.1
N$11
  Bottom 0.254: D2.C R7.1
N$12
  Bottom 0.254: R13.2 39.67,70.92 BMS_LATCH_SSR.1
N$13
  Bottom 0.254: CAN_TRANSCEIVER.4 104.65,22.23 105.66,21.21 U$2.D4(CANRX)
N$14
  Bottom 0.254: CAN_TRANSCEIVER.1 104.65,26.04 108.2,22.48 U$2.D3(CANTX)
N$15
  Bottom 0.254: CAN_TRANSCEIVER1.4 27.37,18.35 23.88,21.84 U$1.D4(CANRX)
N$16  (via drill 0.35 pad 0.55)
  Top 0.254: v34.54,64.26 34.8,64.26 38.86,60.2 38.86,52.1 LED2.A
  Bottom 0.254: BMS_LATCH_SSR.2 38.4,75.18 34.54,75.18 33.53,74.17 33.53,72.39 34.54,71.37 v34.54,64.26
N$17
  Top 0.254: R10.1 57.4,68.06 57.4,68.88 BRAKE_LIGHT_SSR.1
N$18
  Bottom 0.254: R11.1 29.96,69.85 29.96,70.92 BMS_SSR.1
N$19  (via drill 0.35 pad 0.55)
  Top 0.254: LED5.A 34.04,53.34 v34.29,53.59
  Bottom 0.254: R14.2 34.29,54.37 v34.29,53.59
N$20  (via drill 0.35)
  Top 0.254: U$7.2 102.36,68.33 v104.14,70.1
  Bottom 0.254: FAN_SSR1.3 107.37,70.22 D8.C 105.29,70.1 v104.14,70.1
N$21
  Bottom 0.254: U$4.2 102.36,49.9 D9.C 107.37,53.71 FAN_SSR2.3
N$22
  Bottom 0.254: CAN_TRANSCEIVER1.1 25.02,13.08 21.84,16.26 21.84,17.27 U$1.D3(CANTX)
N$23
  Bottom 0.254: U$24.2 U$24.1 84.45,64.64 87.53,67.72 87.53,75.86 85.77,77.62 73,77.62 72.14,78.49 68.07,78.49 66.67,77.09 66.67,76.2 65.91,75.44 AC2_FILTR.1
N$24
  Bottom 0.254: U$24.6 U$24.7 83.19,67.18 84.33,66.04 85.09,66.04 87.12,68.07 87.12,75.69 85.6,77.22 76.45,77.22 73.28,74.04 73.28,73.03 71.88,71.63 68.58,71.63 66.55,73.66 AC1_FILTR.1
N$25
  Bottom 0.254: U$23.7 U$23.6 72.39,71.25 71.5,70.36 BR_FILTR.1
N$26
  Bottom 0.254: U$8.1 18.8,48.88 D4.C 14.68,53 INVERTER_SSR.3
N$27
  Bottom 0.254: R16.1 10.72,55.63 INVERTER_SSR.2
N$28  (via drill 0.35 pad 0.55)
  Top 0.254: LED6.A 24.89,52.58 21.84,55.63 v16.26,55.63
  Bottom 0.254: R16.2 v16.26,55.63
N$29
  Top 0.254: LED8.A 62.22,33.15 R20.2
N$30
  Top 0.254: LED16.C R24.1
N$31
  Bottom 0.254: IMD_SSR.1 29.21,57.61 R21.2
N$32  (via drill 0.35 pad 0.55)
  Top 0.254: LED7.A 27.47,52.58 26.23,52.58 23.11,55.69 v23.11,56.39
  Bottom 0.254: R17.2 v23.11,56.39
N$33
  Bottom 0.254: D3.C 21.07,67.31 R15.1
N$34  (via drill 0.35)
  Top 0.254: v32,59.94 35.56,56.39 35.56,51.85 LED9.A
  Bottom 0.254: IMD_SSR.2 29.51,59.94 v32,59.94
N$35
  Top 0.254: LED14.C R45.2
N$36
  Top 0.254: LED13.C R28.1
N$37
  Top 0.254: LED12.C R27.1
N$38  (via drill 0.35)
  Top 0.254: LED12.A 114.21,28.45 v112.78,28.45
  Bottom 0.254: PUMP_SSR.2 112.78,34.34 112.78,31.59 112.29,31.11 112.29,30.06 112.78,29.57 v112.78,28.45
N$39  (via drill 0.35)
  Top 0.254: LED16.A 111.76,27.59 v111.76,28.45
  Bottom 0.254: FAN_SSR2.2 111.25,50.34 111.25,28.96 v111.76,28.45
N$40  (via drill 0.35 pad 0.55)
  Top 0.254: v16.76,56.64 21.59,56.64 26.64,51.6 LED18.A
  Bottom 0.254: R31.2 16.01,56.64 v16.76,56.64
N$41  (1 unrouted)
  Top 0.254: U$26.+_1 71.88,13.72 U$2.3.3V_2
N$42  (via drill 0.35)
  Top 0.254: v111.25,68.07 v111.25,61.47 | LED13.A 110.2,28.45 v110.24,28.45
  Bottom 0.254: v110.24,28.45 110.24,60.45 v111.25,61.47 | FAN_SSR1.2 112.47,68.07 v111.25,68.07
N$43
  Bottom 0.254: R26.1 13.46,69.9 U$5.3 16.65,71.12 D10.C 16.76,73.81 SOFTWARE_SHUTOFF.2
N$44
  Bottom 0.254: R25.2 11.68,68.12 U$5.2
N$45
  Top 0.254: LED11.C R30.2
N$46  (via drill 0.35 pad 0.55)
  Top 0.254: LED17.A 30.35,53.98 26.67,57.66 22.1,57.66 21.08,58.67 v21.08,59.44
  Bottom 0.254: R26.2 18.02,60.2 20.57,60.2 21.08,59.69 v21.08,59.44
N$47  (via drill 0.35)
  Top 0.254: v25.65,3.81 22.61,6.86 LED11.A
  Bottom 0.254: U$3.6 40.67,2.82 30.96,2.82 28.96,4.83 26.67,4.83 v25.65,3.81
N$48
  Bottom 0.254: U$10.6 89.02,65.66 C7.1
N$49  (via drill 0.35)
  Top 0.254: LED10.A 29.43,26.38 v28.19,25.15
  Bottom 0.254: v28.19,25.15 28.19,24.64 30.23,22.61 38.46,22.61 U$3.15
N$50
  Top 0.254: LED10.C R32.2
N$51  (via drill 0.35)
  Top 0.254: v56.64,56.9 56.01,57.53 U$12.7
  Bottom 0.254: R35.2 51.44,49.4 55.88,53.85 55.88,56.13 v56.64,56.9
N$52  (via drill 0.35 pad 0.55)
  Top 0.254: U$12.5 54.74,60.2 52.07,60.2 51.31,59.44 51.31,57.91 53.59,55.63 56.06,55.63 56.65,55.03 56.65,54.6 v57.15,54.1
  Bottom 0.254: R36.2 53.34,48.4 53.34,50.04 57.15,53.85 v57.15,54.1
N$53  (via drill 0.35)
  Top 0.254: v58.17,55.63 58.17,56.05 57.91,56.3 57.91,57.49 56.79,58.61 56.79,61.46 55.64,62.61 U$12.3
  Bottom 0.254: R37.2 55.36,48.76 55.36,51.21 58.17,54.02 v58.17,55.63
N$54  (via drill 0.35)
  Top 0.254: U$12.1 55.75,65.15 56.39,64.52 56.39,62.48 57.2,61.67 57.2,59.38 57.66,58.93 v57.66,58.67
  Bottom 0.254: R38.2 56.39,51.56 58.93,54.1 58.93,56.64 57.91,57.66 57.91,58.42 v57.66,58.67
N$55  (via drill 0.35)
  Top 0.254: U$11.7 56.9,47.24 57.15,47.5 57.15,49.28 v57.4,49.53
  Bottom 0.254: R39.2 58.04,48.9 v57.4,49.53
N$56  (via drill 0.35)
  Top 0.254: v57.4,50.55 56.64,49.78 U$11.5
  Bottom 0.254: R40.2 59.07,48.76 59.07,49.56 58.08,50.55 v57.4,50.55
N$57  (via drill 0.35)
  Top 0.254: U$11.3 57.15,52.32 57.66,51.82 v57.91,51.82
  Bottom 0.254: R41.2 60.72,48.76 60.72,49.18 58.08,51.82 v57.91,51.82
N$58  (via drill 0.35)
  Top 0.254: v58.42,52.58 58.04,52.96 56.26,52.96 56.24,52.98 56.24,54.86 U$11.1
  Bottom 0.254: R42.2 62.99,48.77 62.63,49.13 62.21,49.13 58.76,52.58 v58.42,52.58
N$59
  Top 0.254: U$12.9 59.55,56.26 58.93,56.88 58.93,59.1 58.1,59.93 58.1,65.85 60.44,68.2 R43.1
N$60
  Top 0.254: R44.1 59.94,66.8 58.52,65.39 58.52,60.08 59.62,58.98 60.14,58.98 U$12.11
N$61  (via drill 0.35 pad 0.55)
  Top 0.254: U$11.16 59.51,55.68 59.11,55.68 58.45,56.34 58.45,58.82 57.61,59.66 57.61,62.32 v57.44,62.48
  Bottom 0.254: U$20.2 U$16.2 58.42,62.48 v57.44,62.48
N$62  (via drill 0.35 pad 0.55)
  Top 0.254: v52.58,58.93 52.58,58.17 56.56,58.17 57.31,57.41 57.31,55.09 57.93,54.47 57.93,54.19 59.8,52.32 U$11.14
  Bottom 0.254: U$22.2 U$21.2 54.36,61.21 52.58,59.44 v52.58,58.93
N$63
  Top 0.254: U$3.20 29.98,24.13 26.92,24.13 26.16,24.89 LED14.A
N$64
  Bottom 0.254: U$2.GND_2 U$26.-
OKHS
  Bottom 0.254: 29.21,53.85 R21.1 32.26,54.09 33.62,52.73 45.32,52.73 47.5,50.55 51.31,50.55 53.88,53.12 53.88,60.16 55.19,61.47 58.98,61.47 X1.P$8 | 29.21,53.85 29.21,53.22 D1.A | R18.1 28.2,53.85 29.21,53.85
OKHS_READ  (via drill 0.35)
  Top 0.254: U$18.7 38.61,44.7 v39.18,45.28
  Bottom 0.254: R5.2 R6.1 37.47,46.99 v39.18,45.28
PUMP1-
  Top 2.032: X2.P$2 96.23,40.6 U$6.P
READ_ACCEL1  (via drill 0.35 pad 0.55)
  Top 0.254: U$18.2 44.96,48.51 v48.26,51.82
  Bottom 0.254: C4.1 AC1_FILTR.2 63.04,73.66 62.28,74.42 | v48.26,51.82 49.88,53.43 52.72,53.43 52.83,53.55 52.83,56.9 51.56,56.9 50.19,58.27 50.19,59.84 51.56,61.21 52.83,61.21 52.83,73.91 53.37,74.45 53.37,75.27 54.27,76.17 60.53,76.17 62.28,74.42 | 62.28,74.42
READ_ACCEL2  (via drill 0.35 pad 0.55)
  Top 0.254: v47.24,52.07 43.94,48.77 43.94,42.93 U$18.3
  Bottom 0.254: v47.24,52.07 48.54,53.37 48.54,64.56 47.92,65.18 46.58,65.18 44.7,67.06 44.7,69.85 44.96,70.1 48.26,70.1 52.96,74.8 52.96,75.56 54.1,76.71 62.98,76.71 C3.1 AC2_FILTR.2
READ_BRAKE  (via drill 0.35 pad 0.55)
  Top 0.254: U$18.1 46.23,48.51 49.02,51.31 v50.29,51.31
  Bottom 0.254: v50.29,51.31 52.01,53.03 52.88,53.03 53.24,53.38 53.24,57.15 53.09,57.3 51.82,57.3 50.6,58.52 50.6,59.49 51.82,60.71 52.98,60.71 53.24,60.96 53.24,73.3 53.77,73.84 53.77,74.97 54.51,75.72 60.24,75.72 61.87,74.08 61.87,70.84 63.12,69.6 C12.2 64.63,70.74 66.92,70.74 BR_FILTR.2
RELAY_CTRL1  (via drill 0.35)
  Top 0.254: v116.84,35.56 116.84,34.1 118.77,32.17 118.77,20.93 119.38,20.32 119.38,17.27 112.27,10.16 90.42,10.16 89.41,9.14 85.34,9.14 84.33,10.16 79.76,10.16 77.22,7.62 56.39,7.62 v54.86,9.14
  Bottom 0.254: PUMP_SSR.1 116.54,35.56 v116.84,35.56 | v54.86,9.14 39.62,9.14 37.08,6.6 4.06,6.6 2.54,8.13 2.54,14.73 U$1.A9
RELAY_CTRL2  (via drill 0.35)
  Top 0.254: v118.36,67.06 118.36,55.88 116.18,53.7 116.18,52.47 117.86,50.8 117.86,40.39 104.14,26.67 104.14,16.76 98.35,10.97 90.12,10.97 88.65,12.45 85.8,12.45 84.33,10.97 79.42,10.97 78.61,10.16 57.91,10.16 v57.4,10.67
  Bottom 0.254: FAN_SSR1.1 118.36,67.77 v118.36,67.06 | v57.4,10.67 40.13,10.67 36.58,7.11 18.8,7.11 17.27,8.64 17.27,14.22 U$1.D2
RELAY_CTRL3  (via drill 0.35)
  Top 0.254: v116.84,53.34 118.36,51.82 118.36,39.37 104.55,25.55 104.55,16.6 98.52,10.57 89.66,10.57 89,9.91 85.85,9.91 85.19,10.57 79.59,10.57 78.67,9.65 57.91,9.65 v57.4,9.14
  Bottom 0.254: FAN_SSR2.1 114.55,55.63 v116.84,53.34 | v57.4,9.14 56.39,8.13 39.18,8.13 37.25,6.2 8.23,6.2 8.13,6.1 8.03,6.2 3.9,6.2 2.03,8.06 2.03,18.29 3.05,19.3 U$1.A8
SCK_TEENSY  (via drill 0.35)
  Top 0.254: U$18.13 42.42,36.45 43.94,34.92 v43.94,33.27
  Bottom 0.254: U$1.D13 14.22,42.16 18.03,38.35 24.13,38.35 29.21,33.27 40.47,33.27 40.62,33.42 41.17,33.42 41.32,33.27 v43.94,33.27 44.16,33.49 54.06,33.49 54.99,34.42 U$17.12
SCL  (via drill 0.35)
  Top 0.254: U$2.A5 98.68,1.65 55.5,1.65 v54.36,2.79 | v28.7,3.81 28.7,17.64 35.19,24.13 41.91,24.13 42.85,25.07 42.85,26.4 43.63,27.18 56.39,27.18 57.4,28.19 ADXL345_BREAKOUT.9
  Bottom 0.254: U$2.A5 102.87,5.84 R34.1 | v54.36,2.79 41.22,2.79 40.84,2.41 29.76,2.41 28.7,3.47 v28.7,3.81
SDA  (via drill 0.35)
  Top 0.254: v27.43,3.81 27.43,17.78 34.29,24.64 40.4,24.64 40.83,25.07 40.83,26.86 41.66,27.69 54.1,27.69 54.61,28.19 54.61,29.72 ADXL345_BREAKOUT.8
  Bottom 0.254: v27.43,3.81 29.34,1.91 96.9,1.91 98.04,3.05 U$2.A4 102.62,8.13 R33.1
SHUTDOWN_A
  Top 1.016: 5ASHUTDOWNFUSE.R1 5ASHUTDOWNFUSE.R2 65.79,34.54 56.34,34.54 52.83,38.05 52.83,41.76 51.54,43.05 51.54,51.97 50.93,52.58 49.02,52.58 46.35,55.24 IMD_SHUTDOWN.6
SHUTDOWN_B
  Bottom 1.016: IMD_SHUTDOWN1.6 49.4,65.48 49.4,55.24 IMD_SHUTDOWN.5
SHUTDOWN_C
  Top 1.016: IMD_SHUTDOWN1.5 49.28,70.61 39.62,70.61 39.12,71.12 22.17,71.12 SOFTWARE_SHUTOFF.P
  Bottom 0.254: D3.A 20.18,69.85 SOFTWARE_SHUTOFF.P
SHUTDOWN_D
  Top 1.016: SOFTWARE_SHUTOFF.S 9.3,73.15 63.5,73.15 66.55,70.1 69.98,70.1 73.79,66.29 73.79,64.48 X1.P$1
  Bottom 0.254: R31.1 12.69,61.73 6.6,67.82 SOFTWARE_SHUTOFF.S
SHUTDOWN_OUT_READ  (via drill 0.35)
  Top 0.254: U$18.5 41.25,42.78 v41.25,47.12
  Bottom 0.254: v41.25,47.12 40.36,48.01 23.62,48.01 22.86,48.77 22.86,49.94 23.98,51.05 23.98,60.19 24.88,61.09 R22.1 21.58,65.28 R15.2
SIGNAL_ACCEL1  (via drill 0.35 pad 0.55)
  Top 0.254: v79.76,68.2 79.76,67.05 ACC1_PU.1 ACC1_PD.1
  Bottom 0.254: U$24.5 80.58,68.2 v79.76,68.2 66.67,68.2 64.87,66.4 64.87,63.54 X1.P$5
SIGNAL_ACCEL2  (via drill 0.35 pad 0.55)
  Top 0.254: ACC2_PD.1 81.03,59.42 ACC2_PU.1 80.01,60.44 v80.01,60.71
  Bottom 0.254: U$24.3 81.92,61.59 81.28,60.96 79.76,60.96 v80.01,60.71 73,67.71 67.8,67.71 66.72,66.64 X1.P$4
SIGNAL_BRAKE  (via drill 0.35 pad 0.55)
  Top 0.254: v72.9,70.1 75.62,67.39 75.62,63.08 X1.P$18
  Bottom 0.254: v72.9,70.1 73.03,69.98 U$23.5
SOFTWARE_SHUTDOWN  (via drill 0.35 pad 0.55)
  Top 0.254: v8.38,67.56 8.13,67.31 6.35,67.31 2.79,63.75 2.79,23.62 U$1.A7
  Bottom 0.254: U$5.1 8.38,68.28 v8.38,67.56
TELEMETRY5V  (via drill 0.35)
  Top 0.254: v101.09,23.37 97.79,23.37 95,26.16 C9.1 91.45,26.42 89.66,28.2 89.66,33.53 90.93,34.8 90.93,35.69 90.42,36.2 U$9.8 93.82,41.31 93.82,44.23 92.71,45.34 90.3,45.34 87.89,47.74 C10.1 87.89,61.22 91.44,64.77 v91.44,67.82 | C5.1 47.62,38.99 REG2.3
  Top 0.406: v47.88,35.56 48.51,34.92 v48.51,32.19 | v56.39,23.37 55.88,23.37 v52.96,26.29 49.72,23.05 48.02,21.34 C13.2 42.92,22.11 REG1.3
  Bottom 0.254: v56.39,23.37 66.55,23.37 69.09,20.83 100.08,20.83 101.09,21.84 v101.09,23.37 101.22,23.5 CAN_TRANSCEIVER.3 104.65,23.5 106.68,21.46 106.68,12.7 112.27,7.11 114.81,7.11 U$2.VIN | U$10.8 91.06,68.2 v91.44,67.82
  Bottom 0.406: v48.51,32.19 48.29,31.97 46.51,31.97 | 46.51,31.97 45.97,31.43 45.97,28.7 46.99,27.69 51.56,27.69 v52.96,26.29 | 46.51,31.97 37.94,31.97 37.08,31.11 ADXL345_BREAKOUT.1 | v47.88,35.56 49.02,36.7 REG2.3
TEMPSENSE  (via drill 0.35 pad 0.55)
  Top 0.254: v48.77,76.71 50.29,78.23 59.76,78.23 66.97,71.02 72.29,71.02 78.74,77.47 85.85,77.47 89.28,74.04 89.28,66.67 BOARD_TEMP.2 88.15,65.53 R9.2 | v41.15,53.47 41.15,48.26 37.34,44.45 U$18.8
  Bottom 0.254: v48.77,76.71 48.77,72.64 46.74,70.61 44.7,70.61 43.94,69.85 43.94,67.06 46.23,64.77 47.75,64.77 48.13,64.39 48.13,53.72 47.88,53.47 v41.15,53.47
VCC
  Top 0.254: C6.2 34.95,17.24 REG1.4
  Top 1.016: REG1.2 38.99,19.81 REG1.4 31.84,16.7 U$3.1
XB8
  Bottom 0.254: U$3.4 40.96,7.11 91.06,7.11 98.04,14.1 U$2.D7(RX3)
XBDI  (via drill 0.35)
  Top 0.254: v40.89,5.33 37.19,5.33 U$3.3 | v56.64,6.35 57.4,7.11 78.74,7.11 v80.77,9.14
  Bottom 0.254: v56.64,6.35 43.18,6.35 42.16,5.33 v40.89,5.33 | U$2.D10(TX2) 90.42,11.43 88.14,9.14 v80.77,9.14
XBDO
  Bottom 0.254: U$3.2 34.85,5 36.63,5 39.25,7.62 89.15,7.62 92.96,11.43 U$2.D9(RX2)

## Text on the board
tDocu: Inverter | Shutdown | BMS Coil | Software | BMS OK | IMD Coil | IMD OK | Latch / Button | MQTT | Assoc | Fan1 | Fan2 | PUMP | HyTech 2019 Main ECU rev1 | Designed By Parker Jones